# EAGLE design ultra-violet-tooth-sensor-mk-2.0 (EAGLE 6.5.0)
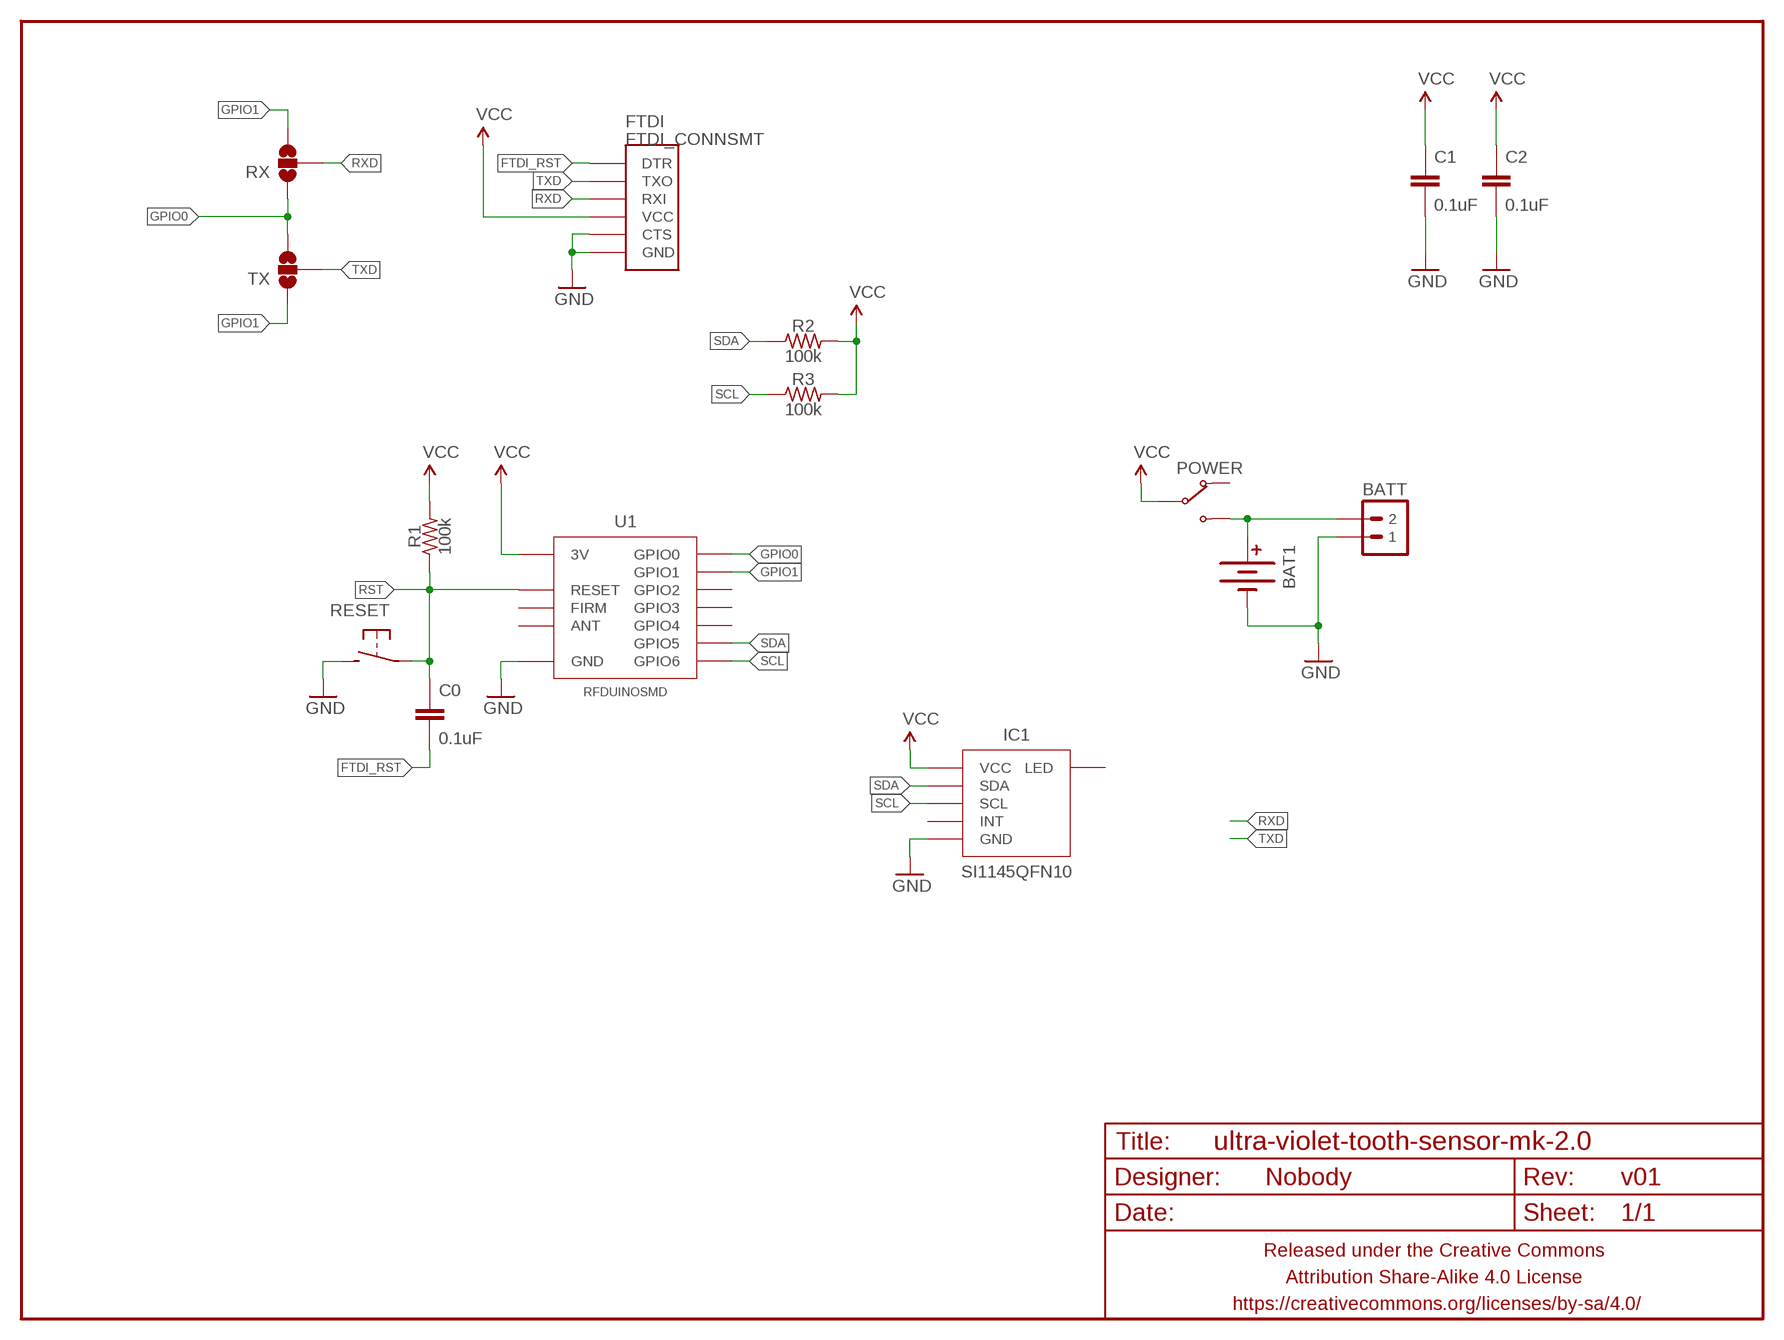
[diagram p0: schematic, sheet 1]

## Parts
BAT1  BATTERY20MMSMD-MINE  [BATTCON_20MM_MINE]
BATT  M02PTH-CENTERED-R+  [1X02-CENTER-R+]
C0  0.1uF  CAPACITOR-CERAMICC0805  [C0805]
C1  0.1uF  CAPACITOR-CERAMICC0805  [C0805]
C2  0.1uF  CAPACITOR-CERAMICC0805  [C0805]
FRAME1  FRAME-LETTERNO_PACKAGE  [DUMMY]
FTDI  FTDI_CONNSMT  [FTDI_CONN_SMT]
IC1  SI1145QFN10  [SI1145]
POWER  SWITCH-SPDTSMD-RA  [SWITCH-SPDT-SMD-RA]
R1  100k  RESISTORR0805  [R0805]
R2  100k  RESISTORR0805  [R0805]
R3  100k  RESISTORR0805  [R0805]
RESET  SPST-NO-TACTSMD-TINY  [TACTILE-SWITCH-SMD]
RX  JUMPER-PAD-3-NOFULL_BOX_SILK  [PAD-JUMPER-3-NO_YES_SILK_FULL_BOX]
TX  JUMPER-PAD-3-NOFULL_BOX_SILK  [PAD-JUMPER-3-NO_YES_SILK_FULL_BOX]
U1  RFDUINOSMD  [RFDUINO-SMD]

## Nets
FTDI_RST: C0.2 FTDI.DTR
GND: BAT1.BOTTOM(-) BATT.1 C1.2 C2.2 FTDI.CTS FTDI.GND IC1.GND RESET.B@1 RESET.B@2 U1.GND@1(GND) U1.GND@2(GND) U1.GND@3(GND) U1.GND@4(GND) U1.GND@5(GND) U1.GND@6(GND) U1.GND@7(GND) U1.GND@8(GND)
GPIO0: RX.1 TX.3 U1.GPIO0
GPIO1: RX.3 TX.1 U1.GPIO1
N$1: BAT1.TOP@1(+) BAT1.TOP@2(+) BATT.2 POWER.1(NO)
RST: C0.1 R1.1 RESET.A@1 RESET.A@2 U1.RESET
RXD: FTDI.RXI RX.2
SCL: IC1.SCL R3.1 U1.GPIO6
SDA: IC1.SDA R2.1 U1.GPIO5
TXD: FTDI.TXO TX.2
VCC: C1.1 C2.1 FTDI.VCC IC1.VCC@1(VCC) IC1.VCC@2(VCC) IC1.VCC@3(VCC) POWER.2(COM) R1.2 R2.2 R3.2 U1.3V
Unconnected: IC1.INT IC1.LED POWER.3(NC) U1.ANT U1.FACTORY(FIRM) U1.GPIO2 U1.GPIO3 U1.GPIO4

## Library data of the parts
BAT1 = A_butts:BATTERY: Battery Holders Various common sizes : AA, AAA, 20mm coin cell and 12mm coin cell. 20MM_4LEGS, BATT-10373
BATT = A_butts:M02: Standard 2-pin 0.1" header. Use with - straight break away headers ( PRT-00116) - right angle break away headers (PRT-00553) - swiss pins (PRT-00743) - machine pins (PRT-00117) - female headers (PRT-00115) Molex polarized connector foot print use with: PRT-08233 with associated crimp pins and housings. 2.54_SCREWTERM for use with PRT-10571. 3.5mm Screw Terminal footprints for PRT-08084 5mm Screw Terminal footprints for use with PRT-08433
C0 C1 C2 = A_butts:CAPACITOR-CERAMIC: CAPACITOR, European symbol
FRAME1 = A_butts:FRAME-LETTER: Schematic Frame Standard 8.5x11 US Letter frame; DESIGNER: Nobody; VERSION: v01
FTDI = A_butts:FTDI_CONN: Connector which mates to FTDI basic or FTDI cable.
IC1 = A_butts:SI1145
POWER = A_butts:SWITCH-SPDT
R1-R3 = A_butts:RESISTOR: RESISTOR, American symbol
RESET = A_butts:SPST-NO-TACT
RX TX = A_butts:JUMPER-PAD-3-NO
U1 = A_butts:RFDUINO

## Board
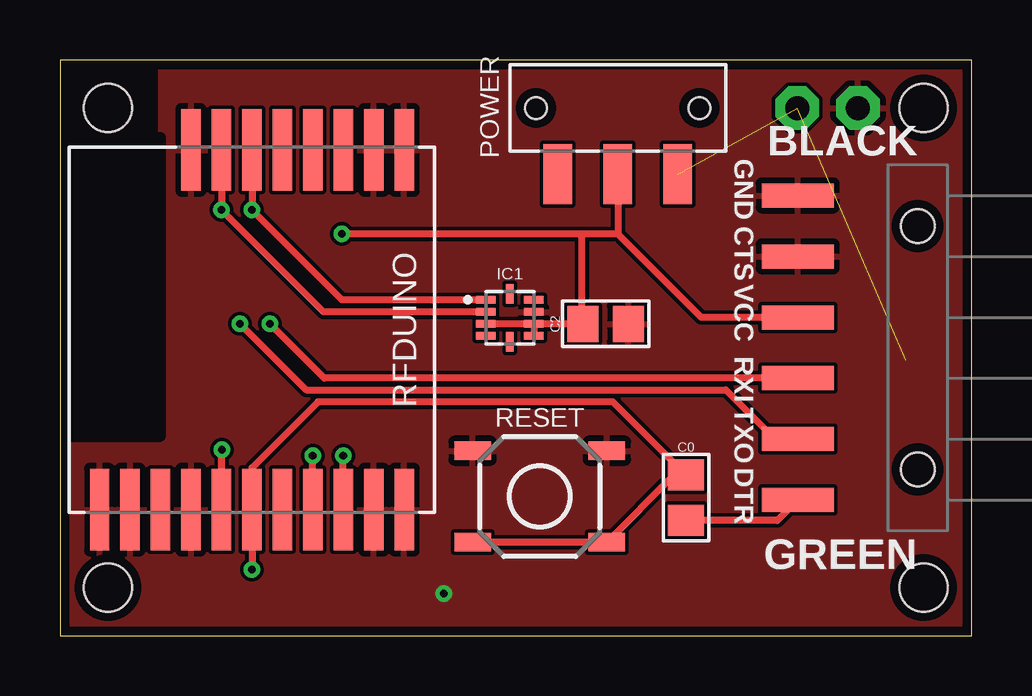
[diagram p1: board, top side]
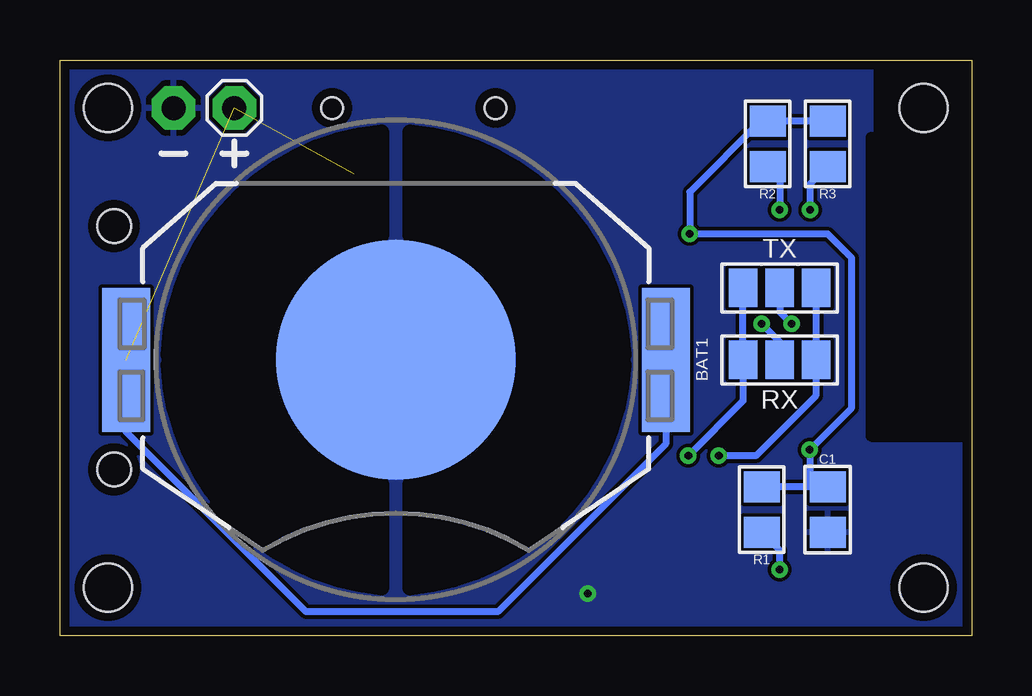
[diagram p2: board, bottom side, seen from below]

Size 38 x 24 mm. Coordinates in mm from the lower left corner, seen from the top.
Outline: 0,24 0,0 38,0 38,24 0,24
Copper layers (1*16): Top 0.0356mm / dielectric 1.5011mm / Bottom 0.0356mm
Design rules "LaenPCBOrder_2": minimum track width 6mil, minimum drill 13mil, track to track 6mil, track to pad 6mil, pad to pad 6mil, via to via 6mil, smd to smd 6mil, copper to edge 15mil, drill to drill 6mil, minimum pad ring 7mil, minimum via ring 7mil, stop-mask expansion 3mil, vias tented up to drill 20mil, thermal gap 10mil
Holes 2 mm at 2,22 2,2 36,22 36,2

### Footprints (pad centres in the part's own frame; a part is rotated, then mirrored left to right if it is on the bottom)
BATTCON_20MM_MINE = smd 10 x 10: BOTTOM 0,0 | smd 6 x 2: TOP@1 0,11.25; TOP@2 0,-11.25
1X02-CENTER-R+ = drill 1 pad 1.8 octagon: 1 -1.27,0; 2 1.27,0
C0805 = smd 1.3 x 1.5: 1 -0.95,0; 2 0.95,0
FTDI_CONN_SMT = smd 1 x 3: CTS 3.81,0; DTR -6.35,0; GND 6.35,0; RXI -1.27,0; TXO -3.81,0; VCC 1.27,0 | hole 1.4: -5.08,-5; 5.08,-5
SI1145 = smd 0.8 x 0.3: GND 1,0.25; INT -1,-0.75; LED 1,0.75; SCL -1,0.25; SDA -1,0.75; VCC@1 -1,-0.25; VCC@2 1,-0.25; VCC@3 1,-0.75 | smd 0.3 x 0.8: NC@1 0,1; NC@2 0,-1
SWITCH-SPDT-SMD-RA = smd 1.2 x 2.5: 1 -2.5,0; 2 0,0; 3 2.5,0 | hole 0.9: -3.4,-2.75; 3.4,-2.75
R0805 = smd 1.3 x 1.5: 1 -0.95,0; 2 0.95,0
TACTILE-SWITCH-SMD = smd 1.524 x 0.762: A@1 -2.794,1.905; A@2 2.794,1.905; B@1 -2.794,-1.905; B@2 2.794,-1.905
PAD-JUMPER-3-NO_YES_SILK_FULL_BOX = smd 1.2 x 1.6: 1 -1.524,0; 2 0,0; 3 1.524,0
RFDUINO-SMD = smd 3.4 x 0.8: 3V 7.5,-1.27; ANT 7.5,-3.81; FACTORY 7.5,1.27; GND@1 -7.5,6.35; GND@2 -7.5,5.08; GND@3 -7.5,-2.54; GND@4 7.5,-6.35; GND@5 7.5,-5.08; GND@6 7.5,-2.54; GND@7 7.5,5.08; GND@8 7.5,6.35; GPIO0 7.5,2.54; GPIO1 7.5,3.81; GPIO2 -7.5,3.81; GPIO3 -7.5,2.54; GPIO4 -7.5,1.27; GPIO5 -7.5,0; GPIO6 -7.5,-1.27; RESET 7.5,0

### Placement (x,y rotation side)
BAT1  24,11.5 270 bottom
BATT  32,22 0 bottom
C0  26.1,5.75 270 top
C1  6,5.25 270 bottom
C2  22.75,13 0 top
FRAME1  0,0 180 top
FTDI  30.75,12 90 top
IC1  18.75,13.25 0 top
POWER  23.25,19.25 180 top
R1  8.75,5.25 90 bottom
R2  8.5,20.5 90 bottom
R3  6,20.5 90 bottom
RESET  20,5.8 180 top
RX  8,11.5 180 bottom
TX  8,14.5 0 bottom
U1  8,12.75 270 top
U$1  [CC-BY-SA-4.0-NO-URL]  50.45,18.8 90 top  (outside the outline)
U$3  [OSHWLOGO_TOP_0.2]  50.2,30.4 0 top  (outside the outline)
U$4  [COW_SMALL_METAL]  43.7,33.7 0 top  (outside the outline)

### Tracks (layer width: path | path; a pad name or v marks a point on that pad's centre or on a via)
FTDI_RST
  Top 0.3: FTDI.DTR 29.9,4.8 C0.2
GND  (via drill 0.33)
  other vias: 16,1.75
  pour Top (isolate 0.152, rank 6): 38.1,24.1 38.1,-0.1 -0.1,-0.1 -0.1,8 4.15,8 4.15,24.1
  pour Bottom (isolate 0.152, rank 6): 38.1,24.1 38.1,-0.1 -0.1,-0.1 -0.1,8 4.15,8 4.15,24.1
GPIO0  (via drill 0.33)
  Top 0.3: U1.GPIO0 v10.54,7.5
  Bottom 0.3: TX.3 RX.1 6.5,11.48 6.5,10 9,7.5 v10.54,7.5 10.54,7.71
GPIO1  (via drill 0.33)
  Top 0.3: U1.GPIO1 v11.81,7.5
  Bottom 0.3: TX.1 RX.3 9.52,9.79 v11.81,7.5
N$1  (2 unrouted)
  Bottom 0.3: BAT1.TOP@1 12.75,8 19.75,1 27.75,1 35.25,8.5 BAT1.TOP@2
RST  (via drill 0.33)
  Top 0.3: 17.25,3.85 RESET.A@2 RESET.A@1 25.6,6.7 C0.1 23.05,9.75 10.75,9.75 8,7 U1.RESET v8,2.75
  Bottom 0.3: v8,2.75 8,3.55 R1.1
RXD  (via drill 0.33)
  Top 0.3: FTDI.RXI 11.02,10.73 v8.75,13
  Bottom 0.3: RX.2 8,12.25 v8.75,13
SCL  (via drill 0.33)
  Top 0.3: U1.GPIO6 v6.73,17.75 10.98,13.5 IC1.SCL
  Bottom 0.3: R3.1 6.73,18.82 v6.73,17.75
SDA  (via drill 0.33)
  Top 0.3: U1.GPIO5 v8,17.75 11.75,14 IC1.SDA
  Bottom 0.3: R2.1 8,19.05 v8,17.75
TXD  (via drill 0.33)
  Top 0.3: FTDI.TXO 29.81,8.19 27.75,10.25 10.25,10.25 v7.5,13
  Bottom 0.3: TX.2 8,13.5 v7.5,13
VCC  (via drill 0.33)
  Top 0.3: IC1.VCC@2 IC1.VCC@1 | IC1.VCC@2 IC1.VCC@3 | POWER.2 23.25,16.75 | 23.25,16.75 21.75,16.75 | 21.75,16.75 v11.75,16.75 | U1.3V 6.73,7.73 v6.75,7.75 | IC1.VCC@2 C2.1 21.75,13.05 21.75,16.75 | FTDI.VCC 26.73,13.27 23.25,16.75
  Bottom 0.3: R3.2 R2.2 8.8,21.45 11.75,18.5 v11.75,16.75 6,16.75 5,15.75 5,9.5 v6.75,7.75 6.75,6.2 | 6.75,6.2 C1.1 | 6.75,6.2 R1.2

### Text on the board
Top: Ultraviolet / Tooth
Bottom: Tooth | Ultraviolet
tPlace: Ultraviolet / Tooth | by schizobovine / <sean@yak.net>
bPlace: Tooth | Ultraviolet